# Altium schematic sheet measurement-ps3-hw.SchDoc
size A2; SheetNumber: 8; SheetTotal: 10
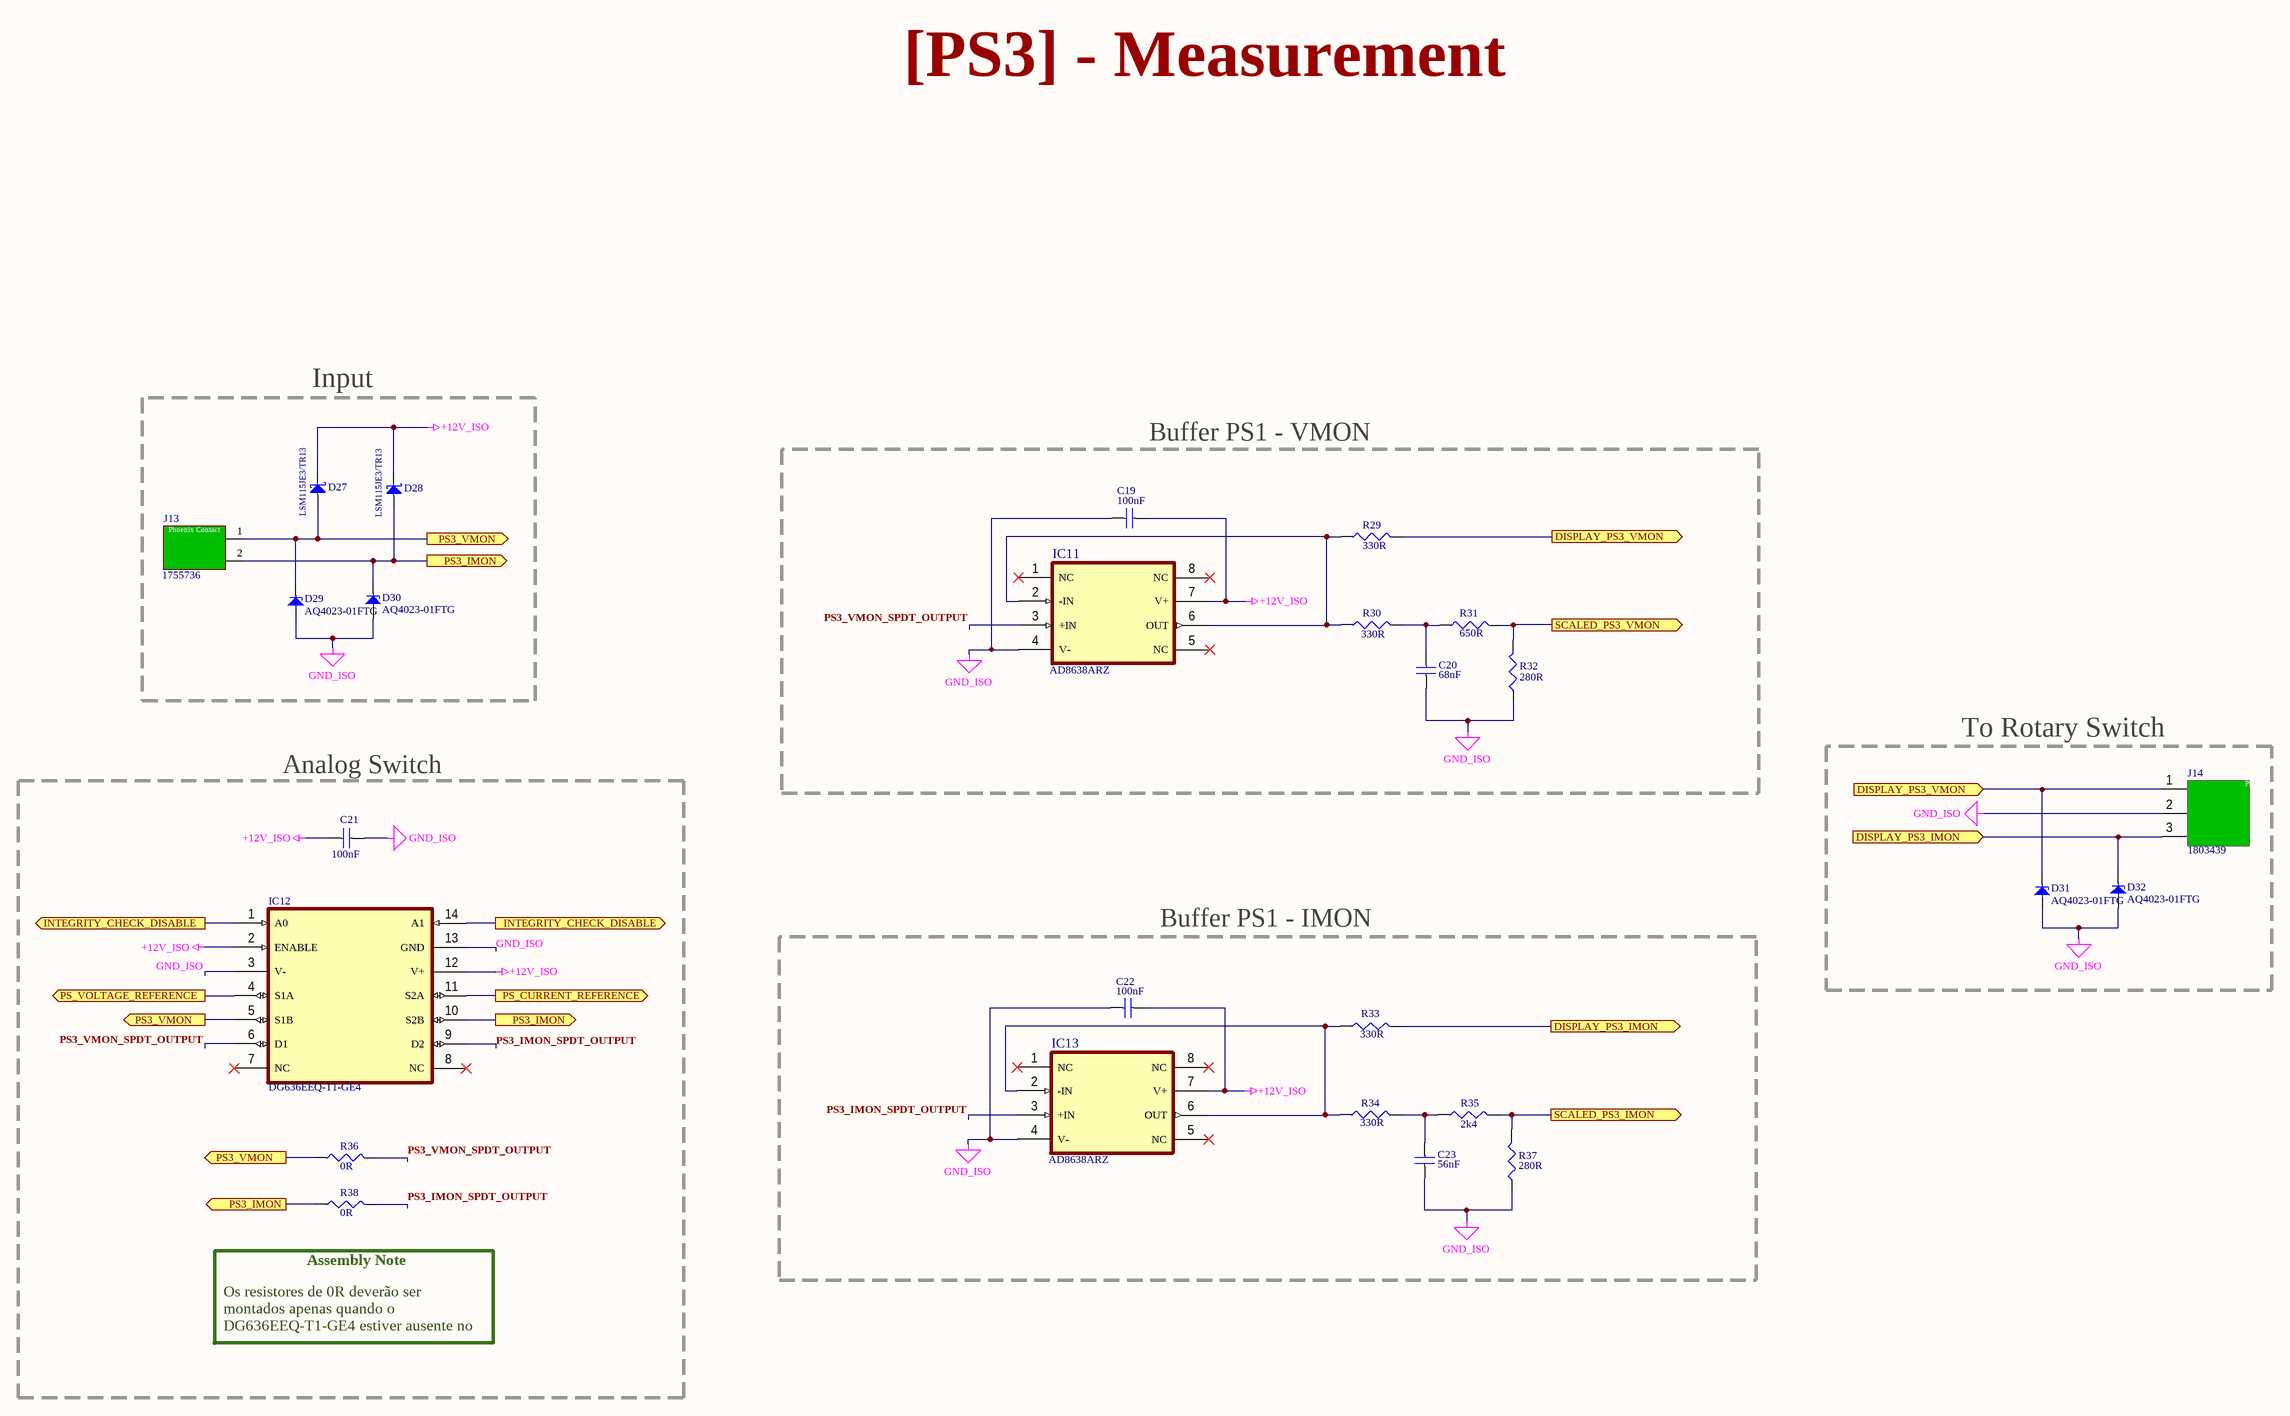
[diagram p0: measurement-ps3-hw.SchDoc]

## Parts
C19  100nF  [C0805]
C20  68nF  [C0805]
C21  100nF  [C0805]
C22  100nF  [C0805]
C23  56nF  [C0805]
D27  LSM115JE3/TR13  [DO-214BA]
D28  LSM115JE3/TR13  [DO-214BA]
D29  AQ4023-01FTG  [SOD-323]
D30  AQ4023-01FTG  [SOD-323]
D31  AQ4023-01FTG  [SOD-323]
D32  AQ4023-01FTG  [SOD-323]
IC11  AD8638ARZ  [SOIC-8]
IC12  DG636EEQ-T1-GE4  [TSSOP-14]
IC13  AD8638ARZ  [SOIC-8]
J13  1755736  [Conector 2 vias]
J14  1803439  [Conector Phoenix 3 vias]
R29  330R  [Resistor 0805]
R30  330R  [Resistor 0805]
R31  650R  [Resistor 0805]
R32  280R  [Resistor 0805]
R33  330R  [Resistor 0805]
R34  330R  [Resistor 0805]
R35  2k4  [Resistor 0805]
R36  0R  [Resistor 0805]
R37  280R  [Resistor 0805]
R38  0R  [Resistor 0805]

## Blocks framed on the sheet
Input: D27-D30 J13
Buffer PS1 - VMON: C19 C20 IC11 R29-R32
Analog Switch: C21 IC12 R36 R38
To Rotary Switch: D31 D32 J14
Buffer PS1 - IMON: C22 C23 IC13 R33-R35 R37

## Ports
DISPLAY_PS3_IMON (in, see measurement-ps3-hw[6C]), DISPLAY_PS3_IMON (out, see measurement-ps3-hw[7B]), DISPLAY_PS3_VMON (in, see measurement-ps3-hw[6B]), DISPLAY_PS3_VMON (out, see measurement-ps3-hw[7B]), INTEGRITY_CHECK_DISABLE (out, see calibration-hw[5B], measurement-output-hw[2B], measurement-output-hw[2D], measurement-output-hw[4B], measurement-output-hw[4D], measurement-ps1-hw[1C], measurement-ps1-hw[3C], measurement-ps2-hw[1B], measurement-ps2-hw[3B], measurement-ps3-hw[1B]), INTEGRITY_CHECK_DISABLE (out, see calibration-hw[5B], measurement-output-hw[2B], measurement-output-hw[2D], measurement-output-hw[4B], measurement-output-hw[4D], measurement-ps1-hw[1C], measurement-ps1-hw[3C], measurement-ps2-hw[1B], measurement-ps2-hw[3B], measurement-ps3-hw[3B]), PS3_IMON (out, see measurement-ps3-hw[2B], measurement-ps3-hw[2C]), PS3_IMON (out, see measurement-ps3-hw[2B], measurement-ps3-hw[3C]), PS3_IMON (out, see measurement-ps3-hw[2C], measurement-ps3-hw[3C]), PS3_VMON (out, see measurement-ps3-hw[2B], measurement-ps3-hw[2C]), PS3_VMON (out, see measurement-ps3-hw[2C]), PS_CURRENT_REFERENCE (out, see calibration-hw[2C], measurement-ps1-hw[3C], measurement-ps2-hw[3C]), PS_VOLTAGE_REFERENCE (out, see calibration-hw[2C], measurement-ps1-hw[1C], measurement-ps2-hw[1C]), SCALED_PS3_IMON (out, see isolated-analog-interface-hw[3B]), SCALED_PS3_VMON (out, see isolated-analog-interface-hw[3B])

## Nets
+12V_ISO: C19.2 C21.1 C22.2 D27.1(C) D28.1(C) IC11.7(V+) IC12.2(ENABLE) IC12.12(V+) IC13.7(V+)
GND_ISO: C19.1 C20.1 C21.2 C22.1 C23.1 D29.2 D30.2 D31.2 D32.2 IC11.4(V-) IC12.3(V-) IC12.13(GND) IC13.4(V-) J14.2 R32.1 R37.1
DISPLAY_PS3_IMON: D32.1 J14.3 R33.2 ; port DISPLAY_PS3_IMON
DISPLAY_PS3_VMON: D31.1 J14.1 R29.2 ; port DISPLAY_PS3_VMON
INTEGRITY_CHECK_DISABLE: IC12.1(A0) IC12.14(A1) ; port INTEGRITY_CHECK_DISABLE
PS3_IMON: D28.2(A) D30.1 IC12.10(S2B) J13.2 R38.1 ; port PS3_IMON
PS3_IMON_SPDT_OUTPUT: IC12.9(D2) IC13.3(+IN) R38.2
PS3_VMON: D27.2(A) D29.1 IC12.5(S1B) J13.1 R36.1 ; port PS3_VMON
PS3_VMON_SPDT_OUTPUT: IC11.3(+IN) IC12.6(D1) R36.2
PS_CURRENT_REFERENCE: IC12.11(S2A) ; port PS_CURRENT_REFERENCE
PS_VOLTAGE_REFERENCE: IC12.4(S1A) ; port PS_VOLTAGE_REFERENCE
SCALED_PS3_IMON: R35.2 R37.2 ; port SCALED_PS3_IMON
SCALED_PS3_VMON: R31.2 R32.2 ; port SCALED_PS3_VMON
NetC20_2: C20.2 R30.2 R31.1
NetC23_2: C23.2 R34.2 R35.1
NetIC11_2: IC11.2(-IN) IC11.6(OUT) R29.1 R30.1
NetIC13_2: IC13.2(-IN) IC13.6(OUT) R33.1 R34.1

Not connected (* = marked no-connect by the designer): IC11 1(NC)* 5(NC)* 8(NC)*; IC12 7(NC)* 8(NC)*; IC13 1(NC)* 5(NC)* 8(NC)*

## Notes on the sheet
- [PS3] - Measurement
- Assembly Note
- Os resistores de 0R deverão ser montados apenas quando o DG636EEQ-T1-GE4 estiver ausente no circuito.
- Title:
- Drawn by:
- Revision:
- Copyright CNPEM 2023.
  This documentation describes Open Hardware and is licensed under the CERN OHL S v2. You may redistribute and modify this documentation under the terms of the CERN OHL S v2. (https://www.ohwr.org/cernohl). This documentation is distributed WITHOUT ANY EXPRESS OR IMPLIED WARRANTY, INCLUDING OF MERCHANTABILITY, SATISFACTORY QUALITY AND FITNESS FOR A PARTICULAR PURPOSE. Please see the CERN OHL S v2 for applicable conditions.
- File:
- Date:
- Project:
- Time:
- Sheet
- of
- ENT - AIS - SEI
  Sistemas Eletrônicos e
  Instrumentação
- (in symbol Conector Phoenix 3 vias) Phoenix Contact
- (in symbol Phoenix 1755736) Phoenix Contact

## Library data of the parts
C19 C21 C22 = Capacitor 100nF
C20 = Capacitor 68nF
C23 = Capacitor 56nF
D27 D28 = LSM115JE3/TR13: DIODE SCHOTTKY 15V, 1A, DO214BA
D29-D32 = AQ4023-01FTG: Unidirectional TVS DIode, 12A, 1.3pF
IC11 IC13 = AD8638ARZ: 16V, Auto-Zero, Rail-to-Rail Output Operational Amplifiers
IC12 = DG636EEQ-T1-GE4: Analog Switch Dual-SPDT, 14 pins; Supplier 1: Newark; Supplier Part Number 1: 56AJ9808
J13 = Phoenix 1755736: Term Block HDR 2POS VERT 5.08MM
J14 = Conector Phoenix 3 vias
R29 R30 R33 R34 = Resistor 330R
R31 = Resistor 650R
R32 R37 = Resistor 280R
R35 = Resistor 2k4
R36 R38 = Resistor 0R - 0805: Size 0805